# EAGLE design sensorNodeRev2 (EAGLE 9.6.2)
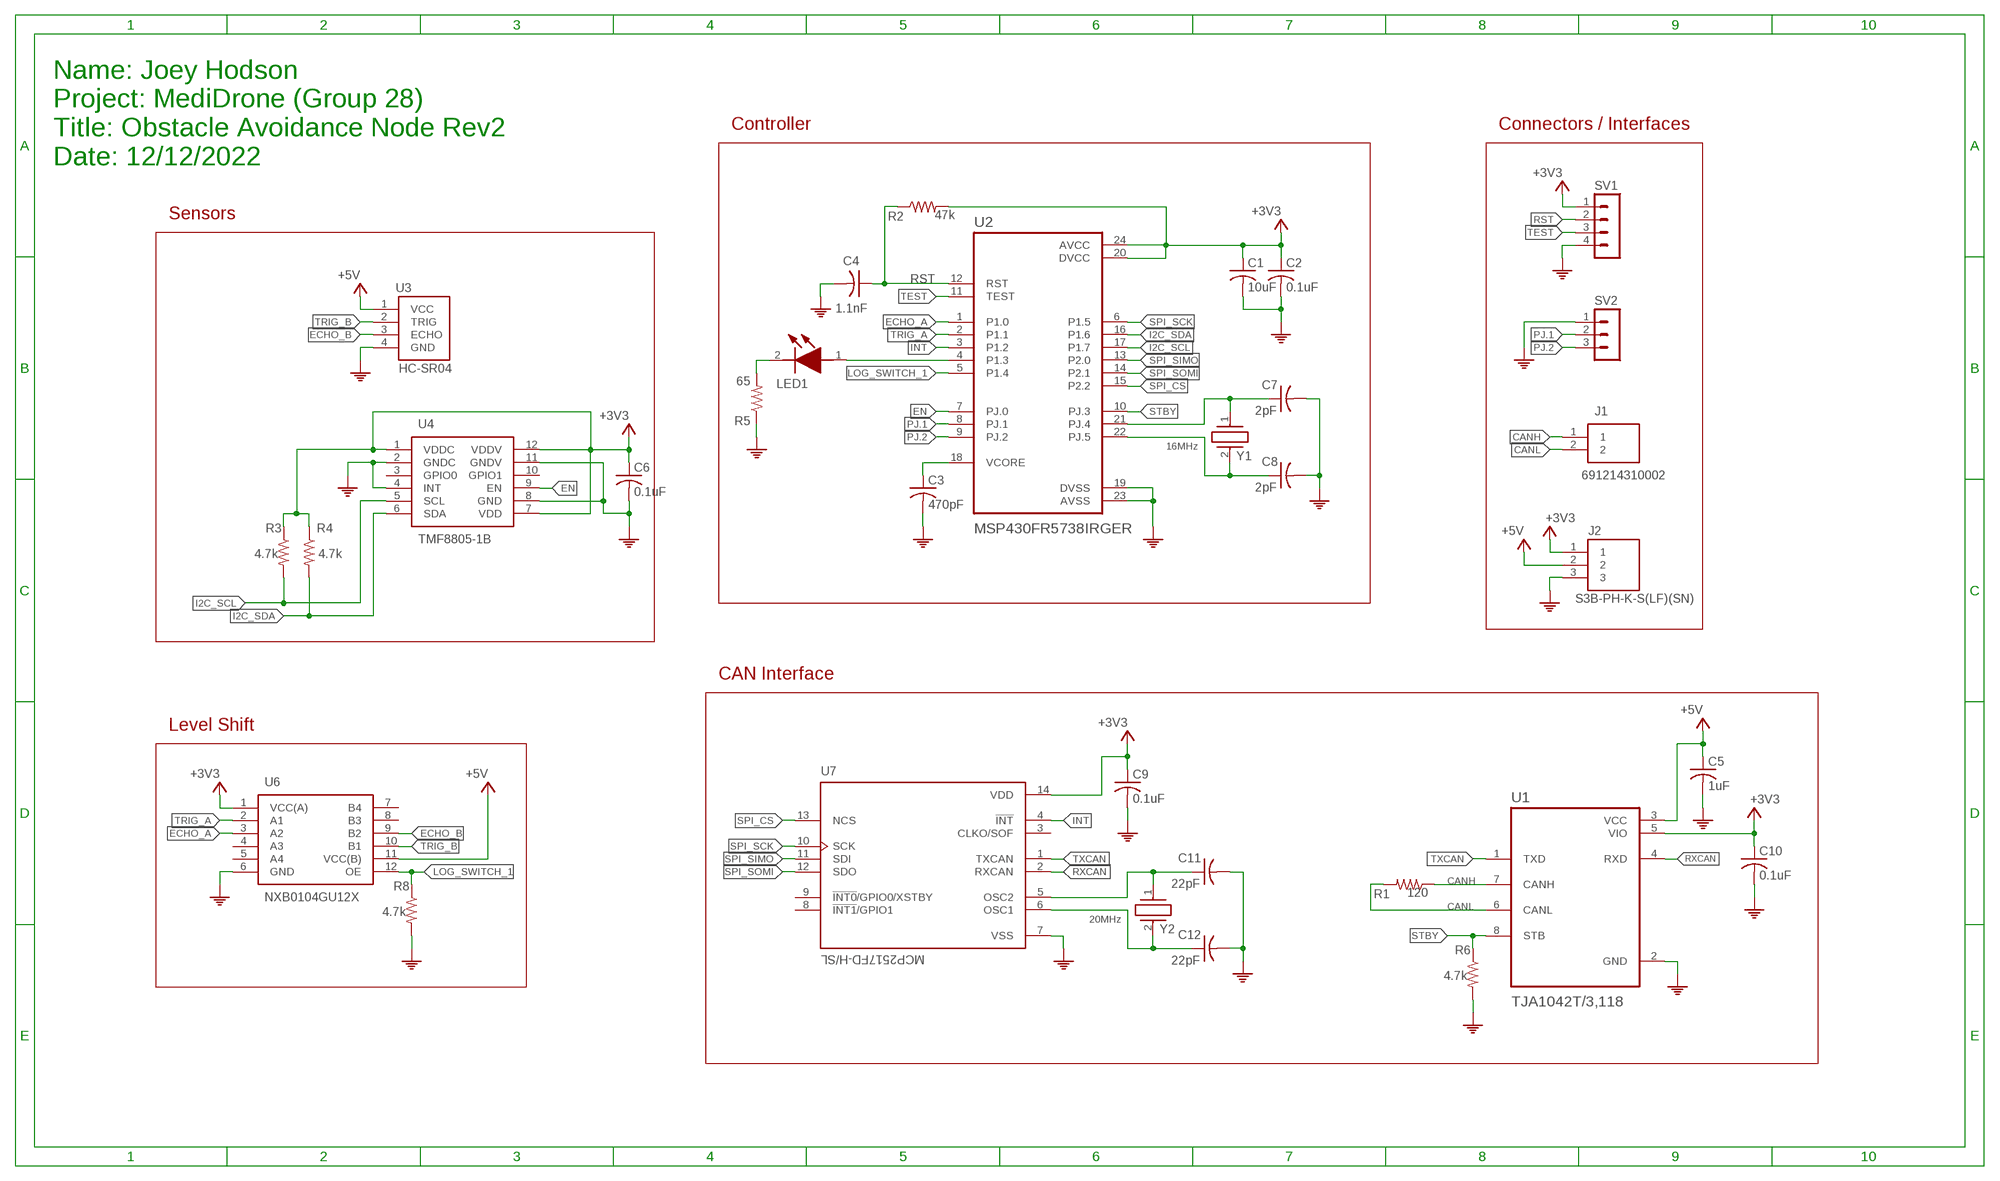
[diagram p0: schematic, sheet 1]

## Parts
C1  10uF  C-USC0805  [C0805]
C2  0.1uF  C-USC0603  [C0603]
C3  470pF  C-USC0603  [C0603]
C4  1.1nF  C-USC0603  [C0603]
C5  1uF  C-USC0603  [C0603]
C6  0.1uF  C-USC0603  [C0603]
C7  2pF  C-USC0603  [C0603]
C8  2pF  C-USC0603  [C0603]
C9  0.1uF  C-USC0603  [C0603]
C10  0.1uF  C-USC0603  [C0603]
C11  22pF  C-USC0603  [C0603]
C12  22pF  C-USC0603  [C0603]
J1  691214310002  [SHDR2W90P0X381_1X2_802X740X850]
J2  S3B-PH-K-S(LF)(SN)  [JST_S3B-PH-K-S(LF)(SN)]
LED1  SML-LX0603IW-TR  [SMLLX0603IWTR]
R1  120  R-US_R0603  [R0603]
R2  47k  R-US_R0603  [R0603]
R3  4.7k  R-US_R0603  [R0603]
R4  4.7k  R-US_R0603  [R0603]
R5  65  R-US_R0603  [R0603]
R6  4.7k  R-US_R0603  [R0603]
R8  4.7k  R-US_R0603  [R0603]
SV1  MA04-1  [MA04-1]
SV2  MA03-1  [MA03-1]
U1  TJA1042T/3,118  [SOIC127P600X175-8N]
U2  MSP430FR5738IRGER  [QFN50P400X400X100-25N]
U3  HC-SR04  [HC-SR04_VARIANT]
U4  TMF8805-1B  [TMF88051B]
U6  NXB0104GU12X  [NXB0104GU12X]
U7  MCP2517FD-H/SL  [SOIC127P600X175-14N]
Y1  HC-49_U-S16000000ABJB  [HC49]
Y2  HC-49_U-S16000000ABJB  [HC49]

## Nets
0: C1.2 C2.2 C3.2 C4.2 C5.2 C6.2 C7.2 C8.2 C9.2 C10.2 C11.2 C12.2 J2.3 R5.1 R6.2 R8.2 SV1.4 SV2.1 U1.2(GND) U2.19(DVSS) U2.23(AVSS) U3.4(GND) U4.2(GNDC) U4.4(INT) U4.8(GND) U4.11(GNDV) U6.6(GND) U7.7(VSS) ; supply symbol labelled PE
+3V3: C1.1 C2.1 C6.1 C9.1 C10.1 J2.1 R2.2 R3.1 R4.1 SV1.1 U1.5(VIO) U2.20(DVCC) U2.24(AVCC) U4.1(VDDC) U4.7(VDD) U4.12(VDDV) U6.1(VCC(A)) U7.14(VDD)
+5V: C5.1 J2.2 U1.3(VCC) U3.1(VCC) U6.11(VCC(B))
CANH: J1.1 R1.1 U1.7(CANH)
CANL: J1.2 R1.2 U1.6(CANL)
ECHO_A: U2.1(P1.0) U6.3(A2)
ECHO_B: U3.3(ECHO) U6.9(B2)
EN: U2.7(PJ.0) U4.9(EN)
I2C_SCL: R3.2 U2.17(P1.7) U4.5(SCL)
I2C_SDA: R4.2 U2.16(P1.6) U4.6(SDA)
INT: U2.3(P1.2) U7.4(!INT)
LOG_SWITCH_1: R8.1 U2.5(P1.4) U6.12(OE)
N$1: C11.1 U7.5(OSC2) Y2.1
N$2: C3.1 U2.18(VCORE)
N$3: C12.1 U7.6(OSC1) Y2.2
N$4: C7.1 U2.21(PJ.4) Y1.1
N$5: C8.1 U2.22(PJ.5) Y1.2
N$8: LED1.1(A) U2.4(P1.3)
N$9: LED1.2(K) R5.2
PJ.1: SV2.2 U2.8(PJ.1)
PJ.2: SV2.3 U2.9(PJ.2)
RST: C4.1 R2.1 SV1.2 U2.12(RST)
RXCAN: U1.4(RXD) U7.2(RXCAN)
SPI_CS: U2.15(P2.2) U7.13(NCS)
SPI_SCK: U2.6(P1.5) U7.10(SCK)
SPI_SIMO: U2.13(P2.0) U7.11(SDI)
SPI_SOMI: U2.14(P2.1) U7.12(SDO)
STBY: R6.1 U1.8(STB) U2.10(PJ.3)
TEST: SV1.3 U2.11(TEST)
TRIG_A: U2.2(P1.1) U6.2(A1)
TRIG_B: U3.2(TRIG) U6.10(B1)
TXCAN: U1.1(TXD) U7.1(TXCAN)
Unconnected: U4.3(GPIO0) U4.10(GPIO1) U6.4(A3) U6.5(A4) U6.7(B4) U6.8(B3) U7.3(CLKO/SOF) U7.8(!INT1!/GPIO1) U7.9(!INT0!/GPIO0/XSTBY)

## Notes on the sheet
- Controller | Connectors / Interfaces
- Name: Joey Hodson
  Project: MediDrone (Group 28)
  Title: Obstacle Avoidance Node Rev2
  Date: 12/12/2022
- Sensors
- 16MHz
- CAN Interface
- Level Shift
- 20MHz

## Library data of the parts
C1-C12 = rcl:C-US: CAPACITOR, American symbol; SPICEPREFIX: C
J1 = 691214310002:691214310002: Wurth Elektronik 2143, 2 Way PCB Terminal Block Source: Datasheet <http://uk.rs-online.com/web/p/products/1918756>; DESCRIPTION: Wurth Elektronik 2143, 2 Way PCB Terminal Block; HEIGHT: 8.5mm; MANUFACTURER_NAME: Wurth Elektronik; MANUFACTURER_PART_NUMBER: 691214310002; MOUSER_PART_NUMBER: 710-691214310002; MOUSER_PRICE-STOCK: https://www.mouser.co.uk/ProductDetail/Wurth-Elektronik/691214310002?qs=sPbYRqrBIVnJ8j3in%252B4Wbg%3D%3D
J2 = S3B-PH-K-S_LF__SN_:S3B-PH-K-S(LF)(SN): Connector Header Through Hole, Right Angle 3 position 0.079" (2.00mm) Check availability <https://pricing.snapeda.com/parts/S3B-PH-K-S%28LF%29%28SN%29/JST%20Sales/view-part?ref=eda>; AVAILABILITY: In Stock; DESCRIPTION: Connector Header Through Hole, Right Angle 3 position 0.079 (2.00mm); MF: JST Sales; MP: S3B-PH-K-S(LF)(SN); PACKAGE: None; PRICE: None
LED1 = SML-LX0603IW-TR:SML-LX0603IW-TR: 2.5 V Red LED 1613 (0605) SMD, Lumex SML-LX0603IW-TR Source: Datasheet <https://www.lumex.com/led-smd-0603.html>; ARROW_PART_NUMBER: SML-LX0603IW-TR; ARROW_PRICE-STOCK: https://www.arrow.com/en/products/sml-lx0603iw-tr/lumex?region=nac; DESCRIPTION: 2.5 V Red LED 1613 (0605) SMD, Lumex SML-LX0603IW-TR; HEIGHT: mm; MANUFACTURER_NAME: Lumex; MANUFACTURER_PART_NUMBER: SML-LX0603IW-TR; MOUSER_PART_NUMBER: 696-SML-LX0603IW; MOUSER_PRICE-STOCK: https://www.mouser.co.uk/ProductDetail/Lumex/SML-LX0603IW-TR?qs=Ma3pWdXK8s%2FPxoga78z1xA%3D%3D
R1-R6 R8 = rcl:R-US_: RESISTOR, American symbol; SPICEPREFIX: R
SV1 = con-lstb:MA04-1: PIN HEADER; OC_FARNELL: unknown; OC_NEWARK: unknown
SV2 = con-lstb:MA03-1: PIN HEADER; OC_FARNELL: unknown; OC_NEWARK: unknown
U1 = TJA1042T_3_118:TJA1042T/3,118: None Check availability <https://pricing.snapeda.com/parts/TJA1042T/3%2C118/NXP%20USA/view-part?ref=eda>; AVAILABILITY: In Stock; DESCRIPTION: 1/1 Transceiver Half CANbus 8-SO; MF: NXP USA; MP: TJA1042T/3,118; PACKAGE: SO-8 NXP Semiconductors; PRICE: None; PURCHASE-URL: https://pricing.snapeda.com/search/part/TJA1042T/3,118/?ref=eda
U2 = MSP430FR5738IRGER:MSP430FR5738IRGER: Check availability <https://pricing.snapeda.com/parts/MSP430FR5738IRGER/Texas%20Instruments/view-part?ref=eda>; AVAILABILITY: In Stock; DESCRIPTION: 24 MHz MCU with 16KB FRAM, 1KB SRAM, 10-bit ADC , comparator, UART/SPI/I2C, timer; MF: Texas Instruments; MP: MSP430FR5738IRGER; PACKAGE: QFN-24 Texas Instruments; PRICE: None; PURCHASE-URL: https://pricing.snapeda.com/search/part/MSP430FR5738IRGER/?ref=eda
U3 = HC-SR04_variantFoot:HC-SR04: Ultrasonic Sensor Module Check availability <https://pricing.snapeda.com/parts/HC-SR04/OSEPP%20Electronics/view-part?ref=eda>; AVAILABILITY: In Stock; DESCRIPTION: Multiple Function Sensor Development Tools Ultrasonic Sensor Module; MF: OSEPP Electronics; MP: HC-SR04; PACKAGE: None; PRICE: None; PURCHASE-URL: https://pricing.snapeda.com/search/part/HC-SR04/?ref=eda
U4 = TMF8805-1B:TMF8805-1B: Distance Sensor Development Tool TMF8805-1B OLGA12 LF T&RDP Source: Datasheet <https://ams.com/documents/20143/4372629/TMF8805_DS000692_4-00.pdf>; DESCRIPTION: Distance Sensor Development Tool TMF8805-1B OLGA12 LF T&RDP; HEIGHT: 1.1mm; MANUFACTURER_NAME: ams; MANUFACTURER_PART_NUMBER: TMF8805-1B; MOUSER_PART_NUMBER: 985-TMF8805-1B; MOUSER_PRICE-STOCK: https://www.mouser.co.uk/ProductDetail/ams/TMF8805-1B?qs=sPbYRqrBIVlwsjHE%2F%252BrL9g%3D%3D
U6 = NXB0104GU12X:NXB0104GU12X: NXB0104 - Dual supply translating transceiver; auto direction sensing; 3-state@en-us Source: Datasheet <https://assets.nexperia.com/documents/data-sheet/NXB0104.pdf>; DESCRIPTION: NXB0104 - Dual supply translating transceiver; auto direction sensing; 3-state@en-us; HEIGHT: 0.5mm; MANUFACTURER_NAME: Nexperia; MANUFACTURER_PART_NUMBER: NXB0104GU12X; MOUSER_PART_NUMBER: 771-NXB0104GU12X; MOUSER_PRICE-STOCK: https://www.mouser.co.uk/ProductDetail/Nexperia/NXB0104GU12X?qs=Cb2nCFKsA8qel1LiVuKg%252Bw%3D%3D
U7 = MCP2517FD-H_SL:MCP2517FD-H/SL: CANbus Controller CAN 2.0 SPI Interface 14-SOIC Check availability <https://pricing.snapeda.com/parts/MCP2517FD-H/SL/Microchip/view-part?ref=eda>; AVAILABILITY: In Stock; DESCRIPTION: CANbus Controller CAN 2.0 SPI Interface 14-SOIC; MF: Microchip; MP: MCP2517FD-H/SL; PACKAGE: SO-14 Microchip; PRICE: None; PURCHASE-URL: https://pricing.snapeda.com/search/part/MCP2517FD-H/SL/?ref=eda
Y1 Y2 = HC-49_U-S16000000ABJB:HC-49_U-S16000000ABJB: Crystals 16MHz 18pF HC49S THROUGH HOLE Source: Datasheet <http://cfd.citizen.co.jp/english/prod-tech/product/pdf/datasheet_AT/HC-49_U-S_E.pdf>; DESCRIPTION: Crystals 16MHz 18pF HC49S THROUGH HOLE; HEIGHT: mm; MANUFACTURER_NAME: Citizen Finetech Miyota; MANUFACTURER_PART_NUMBER: HC-49/U-S16000000ABJB; MOUSER_PART_NUMBER: 695-HC49US16.0ABJB; MOUSER_PRICE-STOCK: https://www.mouser.co.uk/ProductDetail/Citizen-FineDevice/HC-49-U-S16000000ABJB?qs=byeeYqUIh0M5kN9OYTo1Hw%3D%3D

## Board
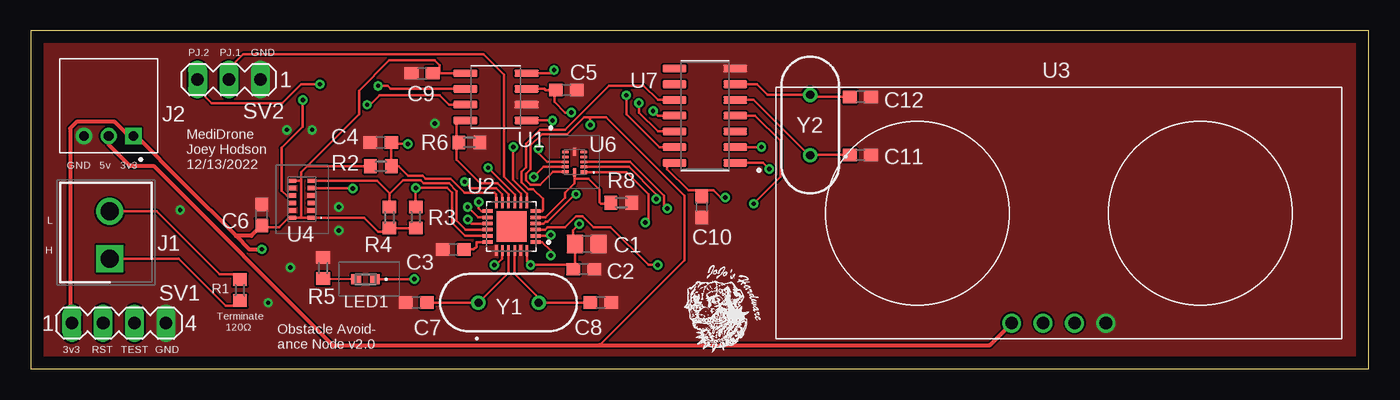
[diagram p1: board, top side]
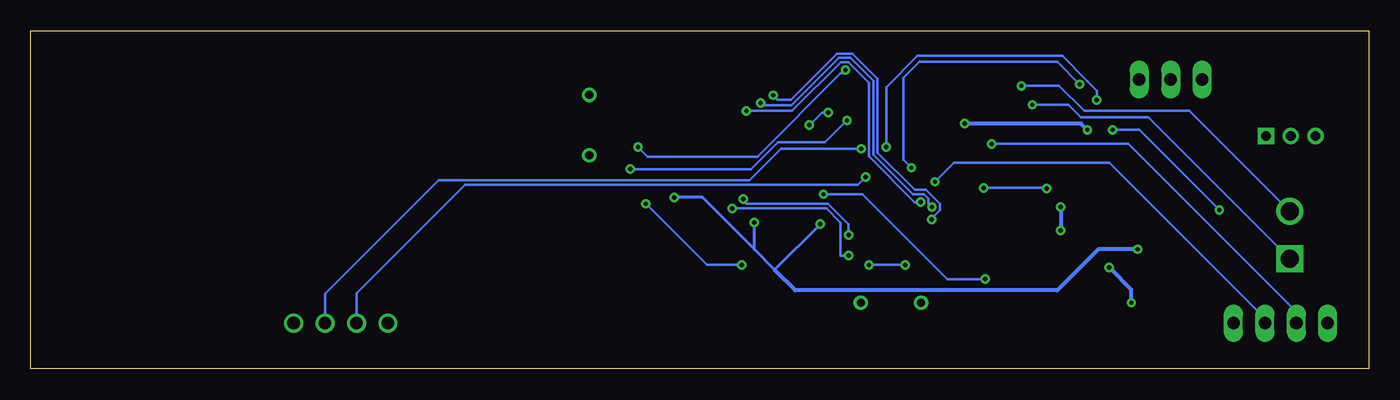
[diagram p2: board, bottom side, seen from below]

Size 108.13 x 27.3 mm. Coordinates in mm from the lower left corner, seen from the top.
Outline: 0,0 108.13,0 108.13,27.3 0,27.3 0,0
Copper layers (1*16): Top 0.035mm / dielectric 1.5mm / Bottom 0.035mm
Design rules "default": minimum track width 6mil, minimum drill 0.35mm, track to track 6mil, track to pad 6mil, pad to pad 6mil, via to via 6mil, smd to smd 6mil, copper to edge 40mil, drill to drill 6mil, minimum pad ring 10mil, minimum via ring 8mil, stop-mask expansion 4mil, vias tented up to drill 0mil, thermal gap 10mil

### Footprints (pad centres in the part's own frame; a part is rotated, then mirrored left to right if it is on the bottom)
C0805 = smd 1.3 x 1.5: 1 -0.95,0; 2 0.95,0
C0603 = smd 1.1 x 1: 1 -0.85,0; 2 0.85,0
SHDR2W90P0X381_1X2_802X740X850 = drill 1.45 pad 2.175 square: 1 0,0 | drill 1.45 pad 2.175: 2 3.81,0
JST_S3B-PH-K-S(LF)(SN) = drill 0.8 square: 1 0,0 | drill 0.8: 2 2,0; 3 4,0
SMLLX0603IWTR = smd 0.8 x 0.8: 1 -0.75,0; 2 0.75,0
R0603 = smd 1 x 1.1: 1 -0.85,0; 2 0.85,0
MA04-1 = drill 1.016 long: 1 -3.81,0; 2 -1.27,0; 3 1.27,0; 4 3.81,0
MA03-1 = drill 1.016 long: 1 -2.54,0; 2 0,0; 3 2.54,0
SOIC127P600X175-8N = smd 1.95 x 0.59: 1 -2.48,1.905; 2 -2.48,0.635; 3 -2.48,-0.635; 4 -2.48,-1.905; 5 2.48,-1.905; 6 2.48,-0.635; 7 2.48,0.635; 8 2.48,1.905
QFN50P400X400X100-25N = smd 0.86 x 0.27: 1 -1.935,1.25; 2 -1.935,0.75; 3 -1.935,0.25; 4 -1.935,-0.25; 5 -1.935,-0.75; 6 -1.935,-1.25; 13 1.935,-1.25; 14 1.935,-0.75; 15 1.935,-0.25; 16 1.935,0.25; 17 1.935,0.75; 18 1.935,1.25 | smd 0.27 x 0.86: 7 -1.25,-1.935; 8 -0.75,-1.935; 9 -0.25,-1.935; 10 0.25,-1.935; 11 0.75,-1.935; 12 1.25,-1.935; 19 1.25,1.935; 20 0.75,1.935; 21 0.25,1.935; 22 -0.25,1.935; 23 -0.75,1.935; 24 -1.25,1.935 | smd 2.45 x 2.45: 25 0,0
HC-SR04_VARIANT = drill 1.02: 1 -3.81,-3.81; 2 -1.27,-3.81; 3 1.27,-3.81; 4 3.81,-3.81
TMF88051B = smd 0.35 x 0.575: 1 -1.5,-0.738; 2 -0.9,-0.738; 3 -0.3,-0.738; 4 0.3,-0.738; 5 0.9,-0.738; 6 1.5,-0.738; 7 1.5,0.738; 8 0.9,0.738; 9 0.3,0.738; 10 -0.3,0.738; 11 -0.9,0.738; 12 -1.5,0.738
NXB0104GU12X = smd 0.5 x 0.32: 1 -0.75,0.85 | smd 0.5 x 0.22: 2 -0.75,0.4; 3 -0.75,0; 4 -0.75,-0.4; 5 -0.75,-0.8; 7 0.75,-0.8; 8 0.75,-0.4; 9 0.75,0; 10 0.75,0.4; 11 0.75,0.8 | smd 0.22 x 0.65: 6 0,-0.825; 12 0,0.825
SOIC127P600X175-14N = smd 1.9 x 0.6: 1 -2.455,3.81; 2 -2.455,2.54; 3 -2.455,1.27; 4 -2.455,0; 5 -2.455,-1.27; 6 -2.455,-2.54; 7 -2.455,-3.81; 8 2.455,-3.81; 9 2.455,-2.54; 10 2.455,-1.27; 11 2.455,0; 12 2.455,1.27; 13 2.455,2.54; 14 2.455,3.81
HC49 = drill 0.65 pad 1.1: 1 -2.44,0; 2 2.44,0

### Placement (x,y rotation side)
C1  44.94,10.09 0 top
C2  44.68,8.04 0 top
C3  34.14,9.64 180 top
C4  28.28,18.28 180 top
C5  43.29,22.52 0 top
C6  18.66,12.43 90 top
C7  31.16,5.35 180 top
C8  46.05,5.34 0 top
C9  31.62,23.88 180 top
C10  54.23,13.08 270 top
C11  67.06,17.27 0 top
C12  67.06,21.97 0 top
J1  6.37,8.9 90 top
J2  8.29,18.81 180 top
LED1  27.05,7.24 180 top
R1  16.89,6.35 90 top
R2  28.28,16.36 180 top
R3  31.11,12.23 90 top
R4  28.98,12.21 90 top
R5  23.62,8.13 270 top
R6  35.43,18.29 0 top
R8  47.72,13.41 0 top
SV1  7.11,3.68 0 top
SV2  16,23.37 180 top
U1  37.59,21.97 180 top
U2  38.85,11.48 180 top
U3  83.09,7.49 0 top
U4  21.9,13.7 90 top
U6  43.94,16.71 180 top
U7  54.48,20.45 180 top
Y1  38.61,5.33 0 top
Y2  62.99,19.68 90 top

### Tracks (layer width: path | path; a pad name or v marks a point on that pad's centre or on a via)
0  (via drill 0.35)
  Bottom 0.2: v20.7,19.3 18.54,19.3 v12.07,12.83
  Bottom 0.305: v24.89,13.08 v24.89,11.18 | v20.97,8.19 19.18,6.39 v19.18,5.33 | v22.73,19.3 23.24,19.81 v32.64,19.81
  pour Top (no thermals): 0,27.3 0,0 108.08,0 108.08,27.3
+3V3  (via drill 0.35)
  Top 0.2: U2.20 38.1,8.89 37.59,8.38 v37.46,8.38 | C2.1 43.72,8.16 | 43.72,8.16 43.49,8.38 v40.39,8.38 40.1,8.67 U2.24 | v44.32,11.68 43.81,11.18 43.81,10.26 C1.1 43.98,8.43 43.72,8.16 | 44.7,15.88 U6.1 48.15,15.86 49.91,14.1 49.91,12.06 v49.66,11.81 | R2.2 22.33,16.36 | 21.84,15.24 21.84,15.88 22.33,16.36 | 21.84,12.2 21.84,15.24 | U4.7 21.8,15.2 21.84,15.24 | C9.1 33.02,23.88 | 33.02,23.88 U1.5 | v56.13,13.84 55.75,13.84 55.18,14.41 54.29,14.41 | 54.29,14.41 54.23,14.35 C10.1 | 54.29,14.41 53.15,14.41 51.43,16.13 51.43,16.51 51.56,16.64 U7.14 | C6.1 18.81,11.43 20.07,11.43 20.83,12.2 U4.12 21.84,12.2 | 33.02,23.88 33.02,24.51 32.62,24.91 28.97,24.91 26.54,22.48 26.54,20.57 22.33,16.36 | R3.1 31.09,11.36 R4.1 28.67,11.05 28.07,11.05 26.92,12.2 U4.1 21.84,12.2
  Top 0.305: 16.57,10.73 12.32,14.99 8.5,18.81 J2.1 7.9,18.81 6.77,19.94 3.68,19.94 3.18,19.43 3.18,3.81 SV1.1 | 16.57,10.73 17.65,9.65 v18.67,9.65 | C6.1 17.81,10.73 16.57,10.73
  Bottom 0.2: v37.46,8.38 v40.39,8.38
  Bottom 0.254: v44.32,11.68 48.01,8 49.66,9.65 | 49.66,9.65 v49.66,11.81 | 49.66,9.65 53.85,13.84 v56.13,13.84
  Bottom 0.305: v18.67,9.65 21.84,9.65 25.16,6.33 46.34,6.33 48.01,8
+5V  (via drill 0.35)
  Top 0.2: U6.11 42.2,15.91 41.14,14.86 40.38,14.86 40.01,15.23 40.01,15.76 40.39,16.14 40.39,18.04 41.3,18.95 43.33,18.95 44.69,20.32 45.21,20.32 | 45.97,1.91 52.83,8.76 52.83,13.97 46.48,20.32 45.21,20.32 | U1.3 41.53,22.61 41.62,22.52 C5.1 42.31,22.39 42.31,21.57 43.18,20.7 v43.69,20.7 | v45.21,19.68 45.21,20.32
  Top 0.305: J2.2 6.29,18.1 8,16.38 9.91,16.38 24.38,1.91 45.97,1.91 77.5,1.91 U3.1
  Bottom 0.2: v43.69,20.7 44.2,20.7 v45.21,19.68
CANH  (via drill 0.35)
  Top 0.2: U1.7 33.78,21.34 33.02,22.1 28.19,22.1 27.43,21.34 v27.18,21.34 | 17.29,5.1 R1.1 16.89,5.33 16.64,5.08 15.75,5.08 11.93,8.9 J1.1
  Bottom 0.2: J1.1 17.79,20.32 23.24,20.32 24.26,21.34 v27.18,21.34
CANL  (via drill 0.35)
  Top 0.2: U1.6 29.08,22.61 28.83,22.86 v28.07,22.86 | R1.2 16.89,7.24 16.51,7.62 15.24,7.62 10.15,12.71 J1.2
  Bottom 0.2: J1.2 14.49,20.83 22.99,20.83 25.02,22.86 v28.07,22.86
ECHO_A  (via drill 0.35)
  Top 0.2: U2.1 41.33,10.23 42.04,9.53 v42.04,9.14 | U6.3 48.44,16.71 51.18,13.97 51.18,13.21 v51.43,12.95
  Bottom 0.2: v42.04,9.14 42.67,9.14 42.67,11.81 43.81,12.95 v51.43,12.95
ECHO_B  (via drill 0.35)
  Top 0.2: U6.9 41.71,16.71 41.02,17.4 v41.02,17.78
  Bottom 0.2: v41.02,17.78 47.5,17.78 50.04,15.24 75.18,15.24 84.36,6.07 U3.3
EN  (via drill 0.35)
  Top 0.2: v38.99,17.91 38.99,15.26 40.1,14.14 U2.7 | U4.9 21.14,13.97 20.7,13.97 20.28,14.39 20.26,14.39 20.26,17.84 21.97,19.56 v21.97,21.72
  Bottom 0.2: v38.99,17.91 38.99,22.73 36.45,25.27 24.76,25.27 22.74,23.25 21.97,22.48 v21.97,21.72
I2C_SCL  (via drill 0.35)
  Top 0.2: R3.2 v31.11,14.6 v31.11,14.61 33.65,14.61 34.04,14.22 34.04,11.81 35.11,10.73 U2.17 | v26.04,14.56 22.67,14.56 U4.5
  Bottom 0.2: v31.11,14.61 26.07,14.61 v26.04,14.56
I2C_SDA
  Top 0.2: R4.2 28.98,14.12 | 28.98,14.12 28.98,14.2 27.98,15.2 U4.6 | 28.98,14.12 30.1,15.24 31.5,15.24 31.75,14.99 33.78,14.99 34.42,14.35 34.42,11.94 35.12,11.23 U2.16
INT  (via drill 0.35)
  Top 0.2: U2.3 40.8,11.22 41.56,11.22 41.77,11.43 43.18,11.43 44.06,12.31 44.58,12.31 45.47,11.43 46.86,11.43 49.91,8.38 v50.67,8.38 | v58.42,13.34 60.58,15.49 60.58,18.41 58.55,20.45 U7.4
  Bottom 0.2: v50.67,8.38 53.47,8.38 v58.42,13.34
LOG_SWITCH_1
  Top 0.2: U6.12 43.94,15.37 | 43.94,15.37 45.08,15.37 45.97,14.48 45.97,13.46 46.1,13.34 46.79,13.34 R8.1 | U2.5 41.61,12.23 43.18,13.8 43.18,14.23 43.94,14.99 43.94,15.37
N$1
  Top 0.2: 65.95,17.53 C11.1 62.92,17.27 62.89,17.25 | 62.89,17.25 Y2.1 | U7.5 58.42,21.72 62.89,17.25
N$2
  Top 0.2: U2.18 36.01,10.23 36.01,9.85 35.8,9.64 C3.1
N$3
  Top 0.2: U7.6 58.67,22.99 59.54,22.12 Y2.2 63.15,21.97 C12.1
N$4
  Top 0.2: U2.21 38.6,7.77 Y1.1 36.15,5.35 C7.1
N$5
  Top 0.2: U2.22 39.1,7.66 41.05,5.71 Y1.2 C8.1
N$8  (via drill 0.35)
  Top 0.2: U2.4 41.45,11.73 41.6,11.88 41.76,11.88 43.98,14.1 v44.07,14.1 | LED1.1 v30.99,7.24
  Bottom 0.2: v44.07,14.1 40.89,14.1 34.04,7.24 v30.99,7.24
N$9
  Top 0.2: R5.2 LED1.2
PJ.1
  Top 0.2: U2.8 39.6,14.14 38.23,15.52 38.23,23.75 36.58,25.4 17.14,25.4 16,24.26 SV2.2
PJ.2  (via drill 0.35)
  Top 0.2: U2.9 39.12,13.43 39.12,14.08 v36.96,16.24 36.96,16.26 | v23.37,22.99 21.84,22.99 20.32,21.46 14.61,21.46 13.46,22.61 SV2.3
  Bottom 0.2: v36.96,16.24 37.59,16.87 37.59,23.52 36.32,24.79 25.18,24.79 v23.37,22.99
RST  (via drill 0.35)
  Top 0.2: U2.12 37.59,14.1 37.46,14.22 35.04,14.22 33.93,15.34 31.9,15.34 31.64,15.59 30.51,15.59 29.74,16.36 R2.1 C4.1 29.25,18.16 v30.48,18.16
  Bottom 0.2: v30.48,18.16 19.43,18.16 6.54,5.27 5.84,4.57 5.84,4.31 SV1.2
RXCAN  (via drill 0.35)
  Top 0.2: v42.29,24.13 42.04,23.88 U1.4 | v59.05,17.91 U7.2
  Bottom 0.2: v42.29,24.13 42.54,23.88 42.67,23.88 49.4,17.14 58.29,17.14 v59.05,17.91
SPI_CS  (via drill 0.35)
  Top 0.2: U2.15 35.64,11.73 v35.31,12.06 | v48.13,22.1 48.13,20.57 50.8,17.91 U7.13
  Bottom 0.2: v35.31,12.06 35.31,12.17 34.67,12.81 34.67,13.34 35.78,14.45 36.67,14.45 39.69,17.46 39.69,23.41 41.74,25.46 42.96,25.46 46.67,21.75 47.79,21.75 v48.13,22.1
SPI_SCK
  Top 0.2: U2.6 41.31,12.73 41.4,12.83 41.4,13.72 40.61,14.51 40.23,14.51 39.66,15.09 39.66,15.9 40.04,16.28 40.04,18.19 41.15,19.3 43.18,19.3 46.74,22.86 49.53,22.86 50.67,21.72 U7.10
SPI_SIMO  (via drill 0.35)
  Top 0.2: U2.13 36.42,12.73 36.2,12.95 v36.2,13.46 | v50.29,20.83 50.67,20.45 U7.11
  Bottom 0.2: v36.2,13.46 36.7,13.46 40.39,17.15 40.39,23.12 42.03,24.76 42.67,24.76 46.6,20.83 v50.29,20.83
SPI_SOMI  (via drill 0.35)
  Top 0.2: U2.14 36.15,12.23 35.31,13.07 v35.3,13.07 | v49.15,21.46 49.15,20.7 50.67,19.18 U7.12
  Bottom 0.2: v49.15,21.46 48.96,21.27 46.65,21.27 42.81,25.11 41.88,25.11 40.04,23.27 40.04,17.3 36.83,14.09 35.93,14.09 35.56,13.72 35.56,13.34 v35.3,13.07
STBY
  Top 0.2: U1.8 34.42,20.07 34.42,18.45 R6.1 34.42,18.12 34.42,16.89 36.32,14.99 37.71,14.99 38.62,14.08 38.62,13.43 U2.10
TEST  (via drill 0.35)
  Top 0.2: U2.11 38.1,14.1 38.09,14.1 37.61,14.58 35.59,14.58 v35.05,15.11
  Bottom 0.2: v35.05,15.11 33.53,16.64 20.96,16.64 8.38,4.06 SV1.3
TRIG_A  (via drill 0.35)
  Top 0.2: v42.04,10.79 41.97,10.73 U2.2 | U6.2 48.33,16.31 50.55,14.1 v50.55,13.72
  Bottom 0.2: v50.55,13.72 50.61,13.65 50.29,13.34 43.69,13.34 42.04,11.68 v42.04,10.79
TRIG_B  (via drill 0.35)
  Top 0.2: U6.10 41.46,16.31 v40.64,15.49
  Bottom 0.2: U3.2 81.79,3.71 81.79,6.1 73.03,14.86 41.27,14.86 v40.64,15.49
TXCAN  (via drill 0.35)
  Top 0.2: U1.1 v42.16,20.07 | U7.1 59.18,16.64 v59.69,16.13
  Bottom 0.2: v42.16,20.07 43.94,18.29 47.75,18.29 49.91,16.13 v59.69,16.13

### Text on the board
tPlace: PJ.2 | PJ.1 | GND | GND | 5v | 3v3 | MediDrone / Joey Hodson / 12/13/2022 | L | H | Terminate / 120Ω | Obstacle Avoid- / ance Node v2.0 | 3v3 | RST | TEST | GND
203bmp: C:/Users/Joeyh/Documents/libraries/EAGLE/SILKSCREEN/rotty.bmp